# EAGLE design magicmouth-v0.1-ds (EAGLE 6.3)
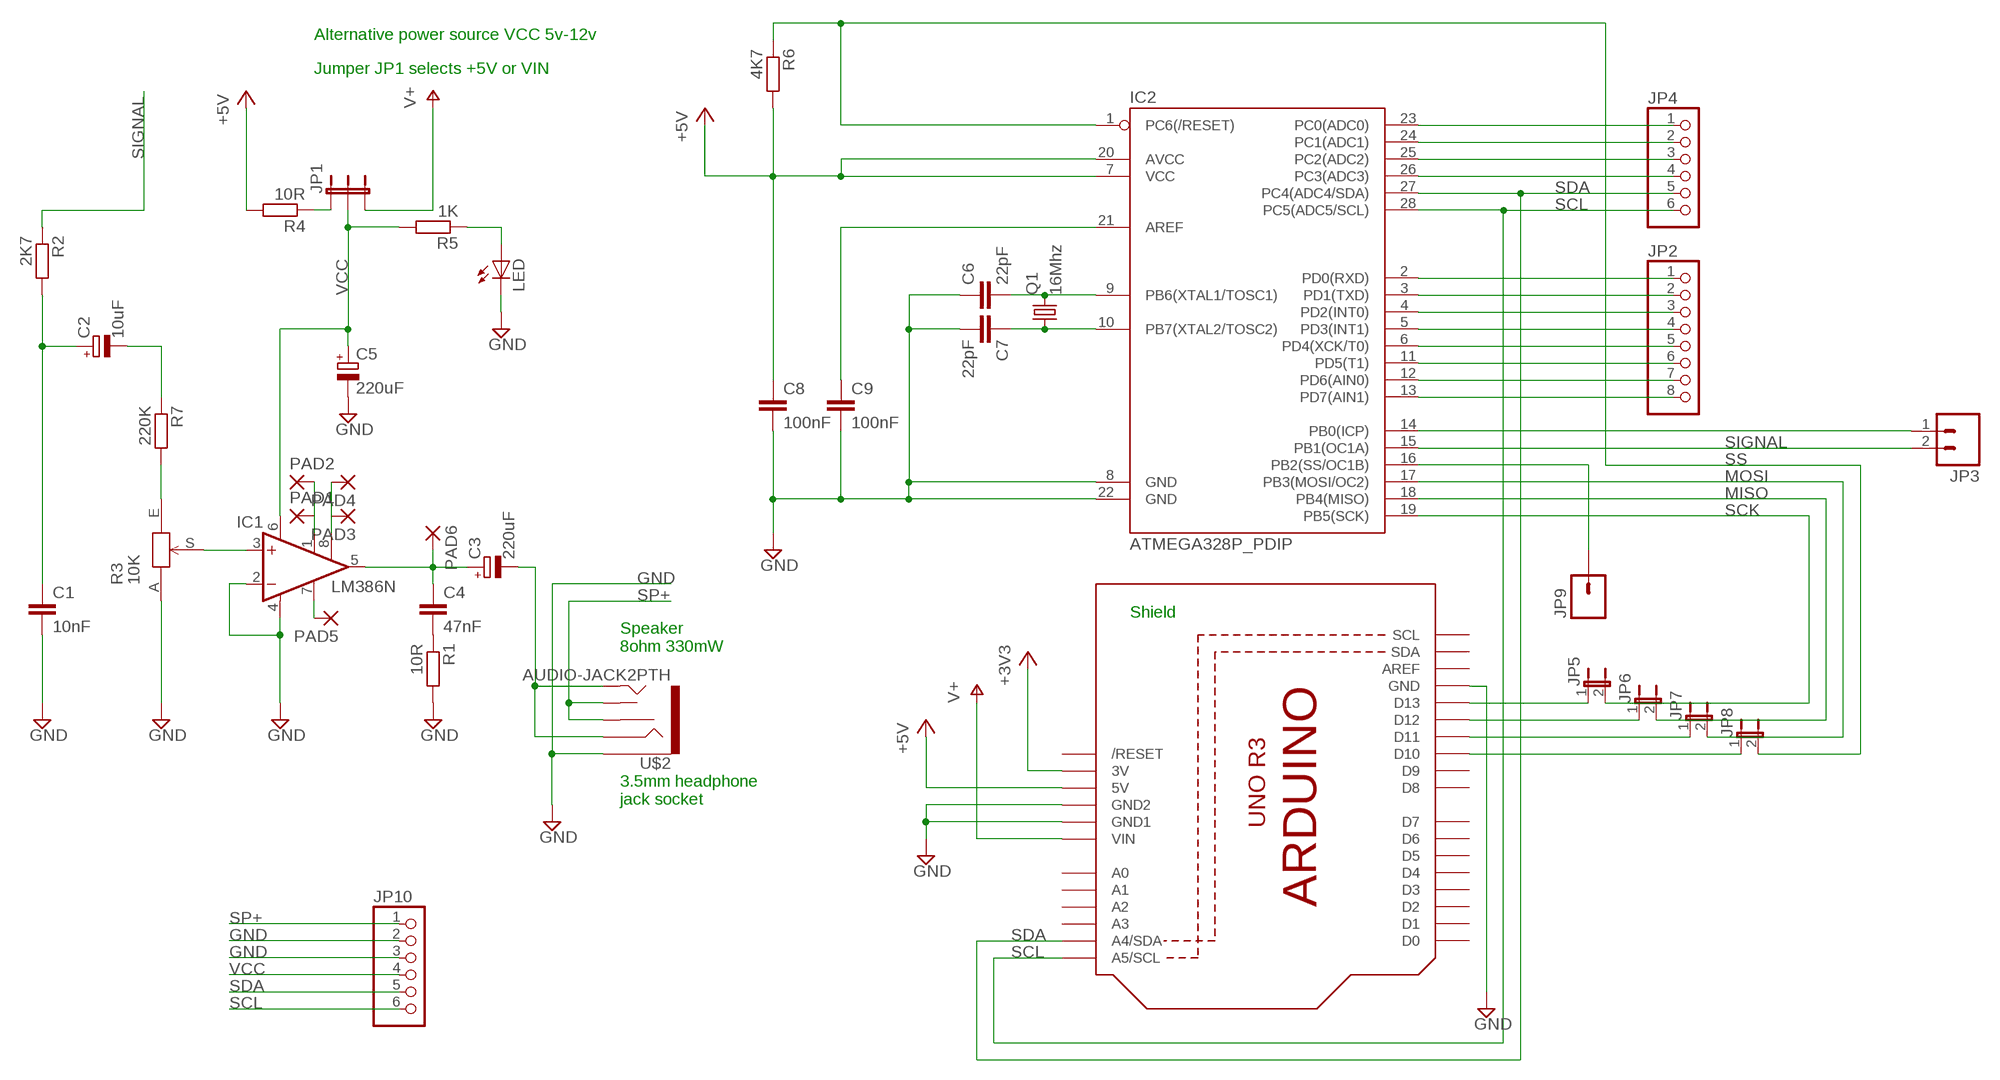
[diagram p0: schematic, sheet 1]

## Parts
C1  10nF  C-EU050-025X075  [C050-025X075]
C2  10uF  CPOL-EUE2.5-7  [E2,5-7]
C3  220uF  CPOL-EUTT2D7  [TT2D7]
C4  47nF  C-EU050-025X075  [C050-025X075]
C5  220uF  CPOL-EUTT2D7  [TT2D7]
C6  22pF  C-EU025-025X050  [C025-025X050]
C7  22pF  C-EU025-025X050  [C025-025X050]
C8  100nF  C-EU025-025X050  [C025-025X050]
C9  100nF  C-EU025-025X050  [C025-025X050]
IC1  LM386N  LM386N-1  [DIL08]
IC2  ATMEGA328P_PDIP  [DIL28-3]
JP1  JUMPER-3PTH  [1X03]
JP2  PINHD-1X8CLEANBIG  [1X08-CLEANBIG]
JP3  M021X02_NO_SILK  [1X02_NO_SILK]
JP4  PINHD-1X6CB  [1X06-CLEANBIG]
JP5  JUMPER-2PTH  [1X02]
JP6  JUMPER-2PTH  [1X02]
JP7  JUMPER-2PTH  [1X02]
JP8  JUMPER-2PTH  [1X02]
JP9  M01SMDNS  [1X01NS]
JP10  PINHD-1X6CB  [1X06-CLEANBIG]
LED  LED3MM  [LED3MM]
PAD1  1,6/0,8  [1,6/0,8]
PAD2  1,6/0,8  [1,6/0,8]
PAD3  1,6/0,8  [1,6/0,8]
PAD4  1,6/0,8  [1,6/0,8]
PAD5  1,6/0,8  [1,6/0,8]
PAD6  1,6/0,8  [1,6/0,8]
Q1  16Mhz  CRYSTALHC49S  [HC49/S]
R1  10R  R-EU_0207/7  [0207/7]
R2  2K7  R-EU_0207/7  [0207/7]
R3  10K  TPOT3352  [3352T]
R4  10R  R-EU_0207/7  [0207/7]
R5  1K  R-EU_0207/7  [0207/7]
R6  4K7  R-EU_0207/7  [0207/7]
R7  220K  R-EU_0207/7  [0207/7]
U1  ARDUINOR3-NOIOREF-NOTEXT  [ARDUINOR3-NOTEXT-NOIOREF]
U$2  AUDIO-JACK2PTH  [AUDIO-JACK]

## Nets
+3V3: U1.3V
+5V: C8.1 IC2.7(VCC) IC2.20(AVCC) R4.2 R6.2 U1.5V
D8: IC2.14(PB0(ICP)) JP3.1
GND: C1.2 C5.- C6.1 C7.2 C8.2 C9.2 IC1.2(-IN) IC1.4(GND) IC2.8(GND) IC2.22(GND) JP10.2 JP10.3 LED.K(C) R1.2 R3.A U1.GND U1.GND1 U1.GND2 U$2.SLEEVE
MISO: IC2.18(PB4(MISO)) JP6.2
MOSI: IC2.17(PB3(MOSI/OC2)) JP7.2
N$1: C3.+ C4.1 IC1.5(OUT) PAD6.1(P)
N$2: C1.1 C2.+ R2.2
N$3: C9.1 IC2.21(AREF)
N$4: C4.2 R1.1
N$5: R3.E R7.2
N$6: C6.2 IC2.9(PB6(XTAL1/TOSC1)) Q1.2
N$7: JP1.1 R4.1
N$8: C3.- U$2.RING U$2.TIP
N$9: IC1.3(+IN) R3.S
N$10: LED.A R5.1
N$11: C7.1 IC2.10(PB7(XTAL2/TOSC2)) Q1.1
N$12: IC2.16(PB2(SS/OC1B)) JP9.1
N$13: IC2.23(PC0(ADC0)) JP4.1
N$15: IC2.24(PC1(ADC1)) JP4.2
N$16: IC2.2(PD0(RXD)) JP2.1
N$17: IC2.3(PD1(TXD)) JP2.2
N$18: IC2.4(PD2(INT0)) JP2.3
N$19: IC2.5(PD3(INT1)) JP2.4
N$20: IC2.6(PD4(XCK/T0)) JP2.5
N$21: IC2.11(PD5(T1)) JP2.6
N$22: IC2.12(PD6(AIN0)) JP2.7
N$23: IC2.13(PD7(AIN1)) JP2.8
N$32: IC2.25(PC2(ADC2)) JP4.3
N$33: IC2.26(PC3(ADC3)) JP4.4
N$58: IC1.1(GAIN) PAD1.1(P) PAD2.1(P)
N$87: C2.- R7.1
N$90: JP5.1 U1.D13
N$91: JP6.1 U1.D12
N$92: JP7.1 U1.D11
N$93: JP8.1 U1.D10
N$94: IC1.7(BYPASS) PAD5.1(P)
N$101: IC1.8(GAIN) PAD3.1(P) PAD4.1(P)
SCK: IC2.19(PB5(SCK)) JP5.2
SCL: IC2.28(PC5(ADC5/SCL)) JP4.6 JP10.6 U1.A5(A5/SCL)
SDA: IC2.27(PC4(ADC4/SDA)) JP4.5 JP10.5 U1.A4(A4/SDA)
SIGNAL: IC2.15(PB1(OC1A)) JP3.2 R2.1
SP+: JP10.1 U$2.RSH U$2.TSH
SS: IC2.1(PC6(/RESET)) JP8.2 R6.1
VCC: C5.+ IC1.6(VS) JP1.2 JP10.4 R5.2
VIN: JP1.3 U1.VIN ; supply symbol labelled V+
Unconnected: U1.A0 U1.A1 U1.A2 U1.A3 U1.AREF U1.D0 U1.D1 U1.D2 U1.D3 U1.D4 U1.D5 U1.D6 U1.D7 U1.D8 U1.D9 U1.RESET(/RESET) U1.SCL U1.SDA

## Notes on the sheet
- Alternative power source VCC 5v-12v
- Jumper JP1 selects +5V or VIN
- Shield
- Speaker
  8ohm 330mW
- 3.5mm headphone
  jack socket

## Library data of the parts
C1 C4 = rcl:C-EU: CAPACITOR, European symbol
C2 C3 C5 = rcl:CPOL-EU: POLARIZED CAPACITOR, European symbol
C6 C7 = rcl:C-EU: CAPACITOR, European symbol; CAPACITANCE: 22 pf
C8 = rcl:C-EU: CAPACITOR, European symbol; CAPACITANCE: 10 nF
C9 = rcl:C-EU: CAPACITOR, European symbol; CAPACITANCE: 100 nF
IC1 = linear:LM386?-*: Low Voltage Audio Power Amplifier Source: http://cache.national.com/ds/LM/LM386.pdf
IC2 = SparkFun-DigitalIC:ATMEGA328P_PDIP: uC used in the Arduino 32kb flash, 1k EEPROM, 2k SRAM This is the through-hole version of this chip.
JP1 = SparkFun-Passives:JUMPER-3
JP2 = adafruit:PINHD-1X8: PIN HEADER
JP3 = SparkFun-Connectors:M02: Header 2 Standard 2-pin 0.1" header. Use with straight break away headers (SKU : PRT-00116), right angle break away headers (PRT-00553), swiss pins (PRT-00743), machine pins (PRT-00117), and female headers (PRT-00115). Molex polarized connector foot print use with SKU : PRT-08233 with associated crimp pins and housings.
JP4 JP10 = adafruit:PINHD-1X6: PIN HEADER
JP5-JP8 = SparkFun-Passives:JUMPER-2: Jumper Basic 0.1" spaced jumper. Use with breakaway headers.
JP9 = SparkFun-Connectors:M01: Header 1 Standard 1-pin 0.1" header. Use with straight break away headers (SKU : PRT-00116), right angle break away headers (PRT-00553), swiss pins (PRT-00743), machine pins (PRT-00117), and female headers (PRT-00115).
LED = led:LED: LED OSRAM: - CHIPLED LG R971, LG N971, LY N971, LG Q971, LY Q971, LO R971, LY R971 LH N974, LH R974 LS Q976, LO Q976, LY Q976 LO Q996 - Hyper CHIPLED LW Q18S LB Q993, LB Q99A, LB R99A - SideLED LS A670, LO A670, LY A670, LG A670, LP A670 LB A673, LV A673, LT A673, LW A673 LH A674 LY A675 LS A676, LA A676, LO A676, LY A676, LW A676 LS A679, LY A679, LG A679 - Hyper Micro SIDELED® LS Y876, LA Y876, LO Y876, LY Y876 LT Y87S - SmartLED LW L88C, LW L88S LB L89C, LB L89S, LG L890 LS L89K, LO L89K, LY L89K LS L896, LA L896, LO L896, LY L896 - TOPLED LS T670, LO T670, LY T670, LG T670, LP T670 LSG T670, LSP T670, LSY T670, LOP T670, LYG T670 LG T671, LOG T671, LSG T671 LB T673, LV T673, LT T673, LW T673 LH T674 LS T676, LA T676, LO T676, LY T676, LB T676, LH T676, LSB T676, LW T676 LB T67C, LV T67C, LT T67C, LS T67K, LO T67K, LY T67K, LW E67C LS E67B, LA E67B, LO E67B, LY E67B, LB E67C, LV E67C, LT E67C LW T67C LS T679, LY T679, LG T679 LS T770, LO T770, LY T770, LG T770, LP T770 LB T773, LV T773, LT T773, LW T773 LH T774 LS E675, LA E675, LY E675, LS T675 LS T776, LA T776, LO T776, LY T776, LB T776 LHGB T686 LT T68C, LB T68C - Hyper Mini TOPLED® LB M676 - Mini TOPLED Santana® LG M470 LS M47K, LO M47K, LY M47K Source: http://www.osram.convergy.de - LUMILED® LXK2-PW12-R00, LXK2-PW12-S00, LXK2-PW14-U00, LXK2-PW14-V00 LXK2-PM12-R00, LXK2-PM12-S00, LXK2-PM14-U00 LXK2-PE12-Q00, LXK2-PE12-R00, LXK2-PE12-S00, LXK2-PE14-T00, LXK2-PE14-U00 LXK2-PB12-K00, LXK2-PB12-L00, LXK2-PB12-M00, LXK2-PB14-N00, LXK2-PB14-P00, LXK2-PB14-Q00 LXK2-PR12-L00, LXK2-PR12-M00, LXK2-PR14-Q00, LXK2-PR14-R00 LXK2-PD12-Q00, LXK2-PD12-R00, LXK2-PD12-S00 LXK2-PH12-R00, LXK2-PH12-S00 LXK2-PL12-P00, LXK2-PL12-Q00, LXK2-PL12-R00 Source: www.luxeon.com
PAD1-PAD6 = wirepad:1,6/0,8: THROUGH-HOLE PAD
Q1 = crystal:CRYSTAL: CRYSTAL; OC_FARNELL: 1667008; OC_NEWARK: unknown
R1 R7 = resistor:R-EU_: RESISTOR, European symbol
R2 R4 R5 = rcl:R-EU_: RESISTOR, European symbol
R3 = t0mpr1c3:TPOT: Bourns thumbwheel trimmer resistor
R6 = rcl:R-EU_: RESISTOR, European symbol; RESISTANCE: 4K7
U1 = adafruit:ARDUINOR3-NOIOREF
U$2 = SparkFun-Connectors:AUDIO-JACK2: Stereo audio jack with bypass switches.

## Board
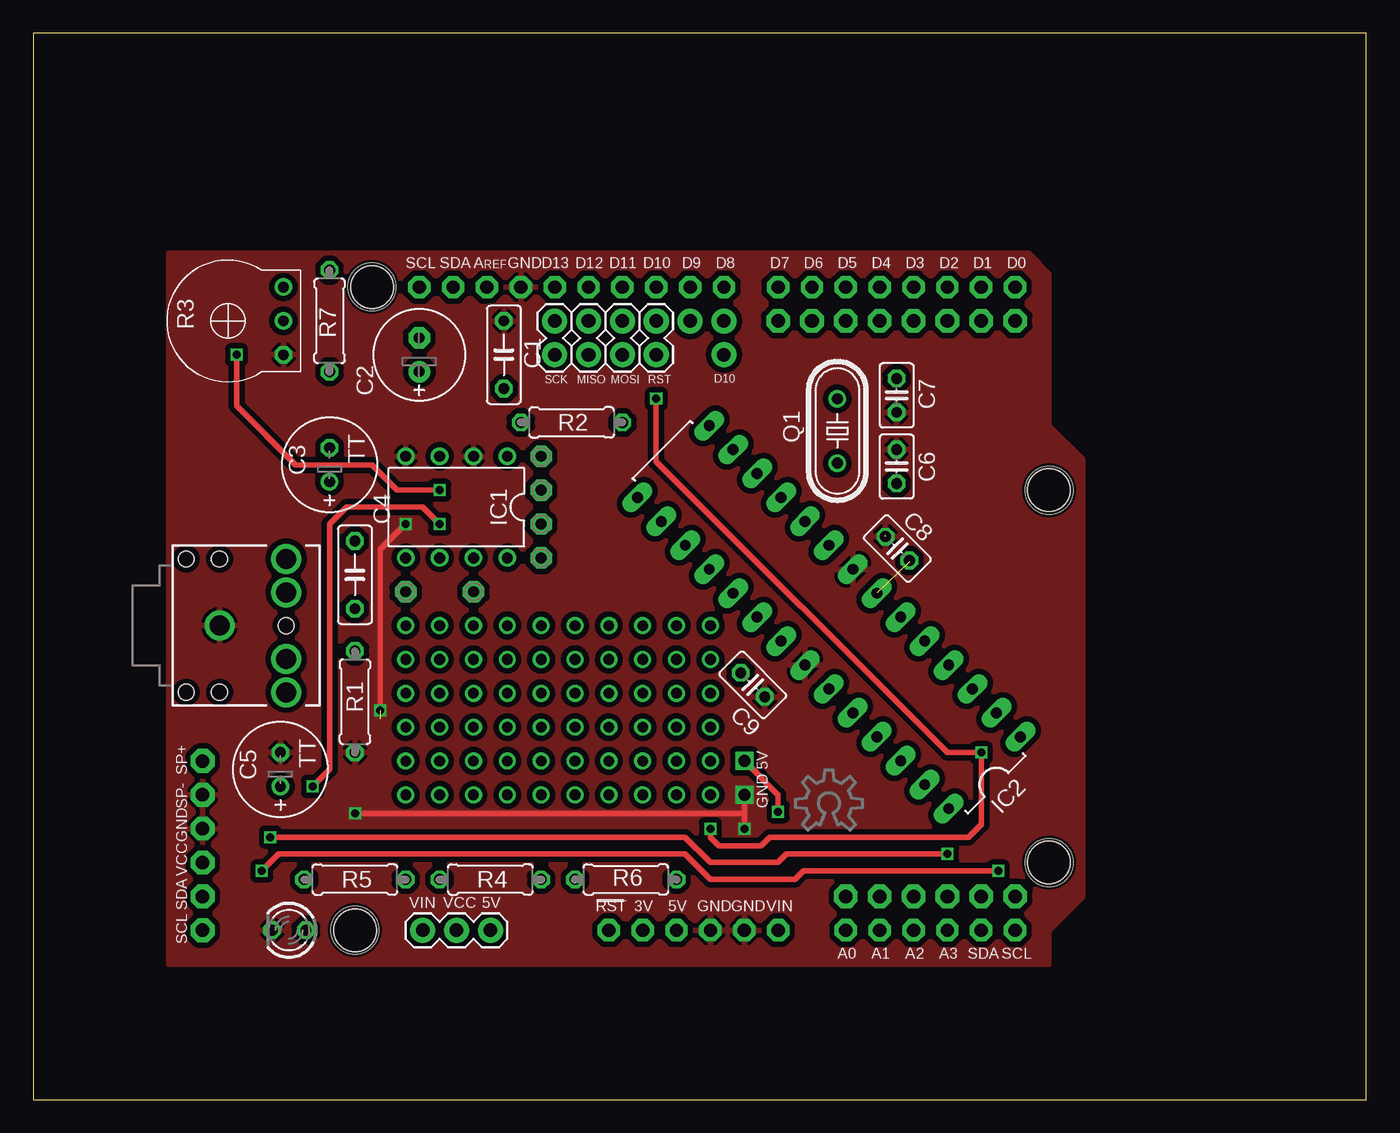
[diagram p1: board, top side]
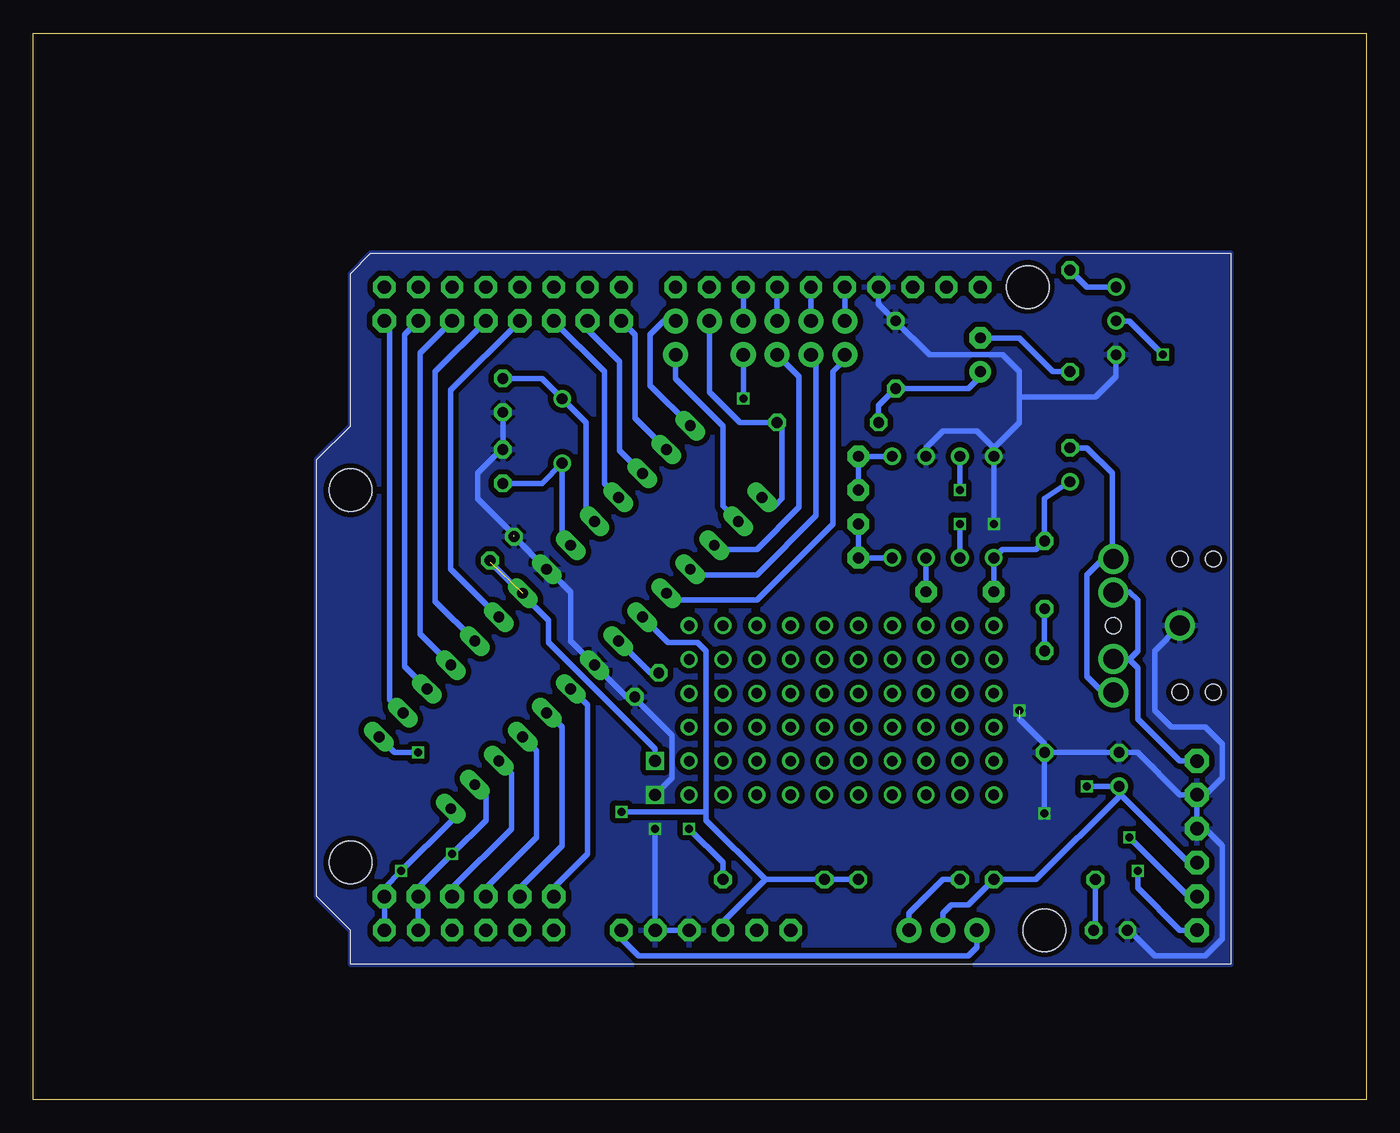
[diagram p2: board, bottom side, seen from below]

Size 100 x 80 mm. Coordinates in mm from the lower left corner, seen from the top.
Outline: 0,0 100,0 100,80 0,80 0,0
Copper layers (1*16): Top 0.035mm / dielectric 1.5mm / Bottom 0.035mm
Design rules "Fusion_eagle_rule_v1.1": minimum track width 6mil, minimum drill 12mil, track to track 6mil, track to pad 6mil, pad to pad 6mil, via to via 6mil, smd to smd 0mil, copper to edge 10mil, drill to drill 10mil, minimum pad ring 10mil, minimum via ring 6mil, stop-mask expansion 2mil, vias tented up to drill 100mil, thermal gap 10mil
Holes 3.2 mm at 76.2,45.72 76.2,17.78 24.13,12.7 25.4,60.96

### Footprints (pad centres in the part's own frame; a part is rotated, then mirrored left to right if it is on the bottom)
C050-025X075 = drill 0.813 octagon: 1 -2.54,0; 2 2.54,0
E2,5-7 = drill 0.813 pad 1.6: + -1.27,0 | drill 0.813 pad 1.6 octagon: - 1.27,0
TT2D7 = drill 0.813: + -1.27,0 | drill 0.813 octagon: - 1.27,0
C025-025X050 = drill 0.813 octagon: 1 -1.27,0; 2 1.27,0
DIL08 = drill 0.813 pad 1.27: 1 -3.81,-3.81; 2 -1.27,-3.81; 3 1.27,-3.81; 4 3.81,-3.81; 5 3.81,3.81; 6 1.27,3.81; 7 -1.27,3.81; 8 -3.81,3.81
DIL28-3 = drill 0.813 long: 1 -16.51,-3.81; 2 -13.97,-3.81; 3 -11.43,-3.81; 4 -8.89,-3.81; 5 -6.35,-3.81; 6 -3.81,-3.81; 7 -1.27,-3.81; 8 1.27,-3.81; 9 3.81,-3.81; 10 6.35,-3.81; 11 8.89,-3.81; 12 11.43,-3.81; 13 13.97,-3.81; 14 16.51,-3.81; 15 16.51,3.81; 16 13.97,3.81; 17 11.43,3.81; 18 8.89,3.81; 19 6.35,3.81; 20 3.81,3.81; 21 1.27,3.81; 22 -1.27,3.81; 23 -3.81,3.81; 24 -6.35,3.81; 25 -8.89,3.81; 26 -11.43,3.81; 27 -13.97,3.81; 28 -16.51,3.81
1X03 = drill 1.016 pad 1.88: 1 0,0; 2 2.54,0; 3 5.08,0
1X08-CLEANBIG = drill 1.016 pad 1.778 octagon: 1 -8.89,0; 2 -6.35,0; 3 -3.81,0; 4 -1.27,0; 5 1.27,0; 6 3.81,0; 7 6.35,0; 8 8.89,0
1X02_NO_SILK = drill 1.016 pad 1.88: 1 0,0; 2 2.54,0
1X06-CLEANBIG = drill 1.016 pad 1.778 octagon: 1 -6.35,0; 2 -3.81,0; 3 -1.27,0; 4 1.27,0; 5 3.81,0; 6 6.35,0
1X02 = drill 1.016 pad 1.88: 1 0,0; 2 2.54,0
1X01NS = drill 1.016 pad 1.88: 1 0,0
LED3MM = drill 0.813 octagon: A -1.27,0; K 1.27,0
1,6/0,8 = drill 0.813 pad 1.6 octagon: 1 0,0
HC49/S = drill 0.813: 1 -2.413,0; 2 2.413,0
0207/7 = drill 0.813 octagon: 1 -3.81,0; 2 3.81,0
3352T = drill 0.8 pad 1.27 octagon: A -2.54,-4.16 | drill 0.8 pad 1.27: E 2.54,-4.16; S 0,-4.16
ARDUINOR3-NOTEXT-NOIOREF = drill 1 pad 1.676 octagon: 3V 35.56,2.54; 5V 38.1,2.54; A0 50.8,2.54; A1 53.34,2.54; A2 55.88,2.54; A3 58.42,2.54; A4 60.96,2.54; A5 63.5,2.54; AREF 23.876,50.8; D0 63.5,50.8; D1 60.96,50.8; D2 58.42,50.8; D3 55.88,50.8; D4 53.34,50.8; D5 50.8,50.8; D6 48.26,50.8; D7 45.72,50.8; D8 41.656,50.8; D9 39.116,50.8; D10 36.576,50.8; D11 34.036,50.8; D12 31.496,50.8; D13 28.956,50.8; GND 26.416,50.8; GND1 43.18,2.54; GND2 40.64,2.54; RESET 33.02,2.54; SCL 18.796,50.8; SDA 21.336,50.8; VIN 45.72,2.54
AUDIO-JACK = drill 1.5 pad 2.184: RING 5,5; RSH 5,2.5; SLEEVE 0,0; TIP 5,-5; TSH 5,-2.5 | hole 1.2: 0,5; -2.5,5; -2.5,-5; 0,-5; 5,0

### Placement (x,y rotation side)
C1  35.31,55.88 90 top
C2  28.96,55.88 90 top
C3  22.23,47.62 90 top
C4  24.13,39.37 270 top
C5  18.54,24.77 90 top
C6  64.77,47.5 270 top
C7  64.77,52.83 270 top
C8  64.83,41.34 135 top
C9  53.98,31.11 315 top
IC1  31.75,44.45 180 top
IC2  59.69,36.2 135 top
JP1  34.29,12.7 180 top
JP2  64.77,58.42 180 top
JP3  51.82,58.42 180 top
JP4  67.31,15.24 0 top
JP5  39.12,58.42 270 top
JP6  41.66,58.42 270 top
JP7  44.2,58.42 270 top
JP8  46.74,58.42 270 top
JP9  51.82,55.88 180 top
JP10  12.7,19.05 270 top
LED  19.18,12.7 180 top
PAD1  38.1,48.26 0 top
PAD2  38.1,45.72 0 top
PAD3  38.1,40.64 0 top
PAD4  38.1,43.18 0 top
PAD5  33.02,38.1 0 top
PAD6  27.94,38.1 0 top
Q1  60.33,50.16 270 top
R1  24.13,29.84 270 top
R2  40.39,50.8 180 top
R3  14.61,58.42 90 top
R4  34.29,16.51 0 top
R5  24.13,16.51 0 top
R6  44.45,16.51 180 top
R7  22.23,58.42 90 top
U1  10.16,10.16 0 top
U$1  [OSHWLOGO_TOL_0.2]  59.69,22.23 0 top
U$2  13.97,35.56 0 top

### Tracks (layer width: path | path; a pad name or v marks a point on that pad's centre or on a via)
+5V  (via drill 0.6, 0.9 pad 1.27)  (1 unrouted)
  Top 0.406: v55.88,21.59 55.88,22.86 v53.34,25.4
  Bottom 0.406: C8.1 65.73,40.33 61.34,35.94 61.34,34.29 53.34,26.29 v53.34,25.4 | 45.09,16.51 R6.2 R4.2 | 45.09,16.51 48.26,13.34 U1.5V | 49.53,21.59 49.53,33.66 50.16,34.29 52.4,34.29 IC2.20 | 49.53,21.59 v55.88,21.59 | 49.53,21.59 49.53,20.95 45.09,16.51
D8
  Bottom 0.406: JP3.1 52.7,58.42 53.72,57.4 53.72,53.58 IC2.14
GND  (via drill 0.6, 0.9 pad 1.27)  (2 unrouted)
  Top 0.406: 53.34,21.46 v53.34,22.86 | 53.34,21.46 v24.13,21.46 | 53.34,21.46 v53.34,20.32 | v26.04,29.21 26.04,41.27 v27.94,43.18
  Bottom 0.406: JP10.2 12.06,22.86 10.79,24.13 10.79,26.67 12.06,27.94 14.61,27.94 15.88,29.21 15.88,33.66 U$2.SLEEVE | JP10.2 JP10.3 12.06,20.32 10.79,19.05 10.79,12.06 12.06,10.79 15.88,10.79 17.78,12.7 LED.K | v24.13,21.46 R1.2 | U1.GND 36.58,59.69 C1.2 32.77,55.88 27.3,55.88 26.04,54.61 26.04,52.7 | R3.A 18.77,54.26 20.32,52.7 26.04,52.7 | IC1.2 33.02,48.9 31.75,50.16 29.21,50.16 27.94,48.9 | 27.94,48.9 IC1.4 v27.94,43.18 | 27.94,48.9 26.04,50.8 26.04,52.7 | R1.2 24.13,26.67 26.04,28.57 | JP10.2 13.97,22.86 17.14,26.04 C5.- R1.2 | C7.2 C6.1 64.9,48.77 66.67,46.99 66.67,45.09 63.94,42.34 | IC2.8 | IC2.8 C8.2 | IC2.8 61.38,39.79 59.69,38.1 59.69,34.4 IC2.22 55.51,30.22 C9.2 54.87,30.11 52.07,27.3 52.07,24.13 v53.34,22.86 | U1.GND2 U1.GND1 v53.34,20.32
  pour Bottom (isolate 0.406): 76.2,12.7 78.74,15.24 78.74,48.01 76.2,50.55 76.2,61.98 74.68,63.5 10.16,63.5 10.16,10.16 76.2,10.16
  pour Top (isolate 0.406): 10.16,10.16 10.16,63.5 74.68,63.5 76.2,61.98 76.2,50.55 78.74,48.01 78.74,15.24 76.2,12.7 76.2,10.16
MISO
  Bottom 0.406: JP6.2 41.27,55.5 41.27,43.81 45.72,39.37 50.29,39.37 IC2.18
MOSI
  Bottom 0.406: JP7.2 42.55,54.23 42.55,44.45 45.72,41.27 48.61,41.27 IC2.17
N$1
  Bottom 0.406: PAD6.1 IC1.5 27.3,41.27 24.77,41.27 C4.1 24.13,45.09 C3.+
N$2
  Bottom 0.406: C2.+ 28.96,54.23 29.84,53.34 C1.1 36.58,52.07 R2.2
N$3
  Bottom 0.406: C9.1 53.71,32.01 IC2.21
N$4
  Bottom 0.406: C4.2 R1.1
N$5
  Bottom 0.406: R3.E 20.95,60.96 R7.2
N$6
  Bottom 0.406: C6.2 61.85,46.23 Q1.2 60.33,42.22 IC2.9
N$7
  Bottom 0.406: R4.1 31.75,16.51 34.29,13.97 JP1.1
N$8
  Bottom 0.406: C3.- 20.95,48.9 19.05,46.99 19.05,40.64 | U$2.TIP 19.05,30.48 19.68,30.48 20.95,31.75 20.95,39.37 19.68,40.64 19.05,40.64 | 19.05,40.64 U$2.RING
N$9  (via drill 0.6)
  Top 0.406: v15.24,55.88 15.24,52.07 19.68,47.62 25.4,47.62 27.3,45.72 v30.48,45.72
  Bottom 0.406: R3.S 17.78,58.42 v15.24,55.88 | v30.48,45.72 IC1.3
N$10
  Bottom 0.406: R5.1 20.32,13.34 20.45,13.21 LED.A
N$11
  Bottom 0.406: C7.1 61.85,54.1 Q1.1 58.55,50.8 58.55,44.03 IC2.10
N$12
  Bottom 0.406: JP9.1 51.82,54.1 48.26,50.55 48.26,44.52 IC2.16
N$13
  Bottom 0.406: JP4.1 60.96,15.88 58.42,18.41 58.42,29.59 59.64,30.81 IC2.23
N$15
  Bottom 0.406: JP4.2 63.5,15.88 60.33,19.05 60.33,27.94 61.4,29.01 IC2.24
N$16
  Bottom 0.406: JP2.1 73.28,58.04 73.28,30.03 IC2.2
N$17
  Bottom 0.406: JP2.2 72.14,57.4 72.14,32.48 IC2.3
N$18
  Bottom 0.406: JP2.3 70.99,56.01 70.99,34.93 IC2.4
N$19
  Bottom 0.406: JP2.4 69.85,54.61 69.85,37.38 IC2.5
N$20
  Bottom 0.406: JP2.5 68.71,53.21 68.71,39.82 IC2.6
N$21
  Bottom 0.406: JP2.6 57.15,54.61 57.15,46.23 IC2.11
N$22
  Bottom 0.406: JP2.7 58.42,57.78 56.01,55.37 56.01,48.68 IC2.12
N$23
  Bottom 0.406: JP2.8 54.86,57.4 54.86,51.13 IC2.13
N$25  (via drill 0.8 pad 1.27)
  other vias: 40.64,35.56
N$26  (via drill 0.8 pad 1.27)
  other vias: 43.18,35.56
N$28  (via drill 0.8 pad 1.27)
  other vias: 45.72,35.56
N$29  (via drill 0.8 pad 1.27)
  other vias: 45.72,33.02
N$32
  Bottom 0.406: JP4.3 66.04,15.88 62.23,19.68 62.23,26.16 IC2.25
N$33
  Bottom 0.406: JP4.4 68.58,15.88 64.14,20.32 64.14,24.48 IC2.26
N$34  (via drill 0.8 pad 1.27)
  other vias: 43.18,33.02
N$35  (via drill 0.8 pad 1.27)
  other vias: 40.64,33.02
N$36  (via drill 0.8 pad 1.27)
  other vias: 40.64,30.48
N$37  (via drill 0.8 pad 1.27)
  other vias: 43.18,30.48
N$38  (via drill 0.8 pad 1.27)
  other vias: 45.72,30.48
N$39  (via drill 0.8 pad 1.27)
  other vias: 45.72,27.94
N$40  (via drill 0.8 pad 1.27)
  other vias: 43.18,27.94
N$41  (via drill 0.8 pad 1.27)
  other vias: 40.64,27.94
N$42  (via drill 0.8 pad 1.27)
  other vias: 40.64,25.4
N$43  (via drill 0.8 pad 1.27)
  other vias: 43.18,25.4
N$44  (via drill 0.8 pad 1.27)
  other vias: 45.72,25.4
N$45  (via drill 0.8 pad 1.27)
  other vias: 45.72,22.86
N$46  (via drill 0.8 pad 1.27)
  other vias: 43.18,22.86
N$47  (via drill 0.8 pad 1.27)
  other vias: 48.26,35.56
N$48  (via drill 0.8 pad 1.27)
  other vias: 50.8,35.56
N$49  (via drill 0.8 pad 1.27)
  other vias: 48.26,33.02
N$50  (via drill 0.8 pad 1.27)
  other vias: 50.8,33.02
N$51  (via drill 0.8 pad 1.27)
  other vias: 48.26,30.48
N$52  (via drill 0.8 pad 1.27)
  other vias: 50.8,30.48
N$53  (via drill 0.8 pad 1.27)
  other vias: 40.64,22.86
N$54  (via drill 0.8 pad 1.27)
  other vias: 27.94,35.56
N$56  (via drill 0.8 pad 1.27)
  other vias: 33.02,35.56
N$57  (via drill 0.8 pad 1.27)
  other vias: 35.56,35.56
N$58
  Bottom 0.406: PAD2.1 PAD1.1 IC1.1
N$59  (via drill 0.8 pad 1.27)
  other vias: 38.1,33.02
N$60  (via drill 0.8 pad 1.27)
  other vias: 35.56,33.02
N$61  (via drill 0.8 pad 1.27)
  other vias: 33.02,33.02
N$62  (via drill 0.8 pad 1.27)
  other vias: 30.48,33.02
N$63  (via drill 0.8 pad 1.27)
  other vias: 27.94,33.02
N$64  (via drill 0.8 pad 1.27)
  other vias: 27.94,30.48
N$65  (via drill 0.8 pad 1.27)
  other vias: 30.48,30.48
N$66  (via drill 0.8 pad 1.27)
  other vias: 33.02,30.48
N$67  (via drill 0.8 pad 1.27)
  other vias: 35.56,30.48
N$68  (via drill 0.8 pad 1.27)
  other vias: 38.1,30.48
N$69  (via drill 0.8 pad 1.27)
  other vias: 38.1,27.94
N$70  (via drill 0.8 pad 1.27)
  other vias: 35.56,27.94
N$71  (via drill 0.8 pad 1.27)
  other vias: 33.02,27.94
N$72  (via drill 0.8 pad 1.27)
  other vias: 30.48,27.94
N$73  (via drill 0.8 pad 1.27)
  other vias: 27.94,27.94
N$74  (via drill 0.8 pad 1.27)
  other vias: 27.94,25.4
N$75  (via drill 0.8 pad 1.27)
  other vias: 48.26,27.94
N$76  (via drill 0.8 pad 1.27)
  other vias: 30.48,25.4
N$77  (via drill 0.8 pad 1.27)
  other vias: 33.02,25.4
N$78  (via drill 0.8 pad 1.27)
  other vias: 35.56,25.4
N$79  (via drill 0.8 pad 1.27)
  other vias: 38.1,25.4
N$80  (via drill 0.8 pad 1.27)
  other vias: 38.1,22.86
N$81  (via drill 0.8 pad 1.27)
  other vias: 35.56,22.86
N$82  (via drill 0.8 pad 1.27)
  other vias: 33.02,22.86
N$83  (via drill 0.8 pad 1.27)
  other vias: 30.48,22.86
N$84  (via drill 0.8 pad 1.27)
  other vias: 27.94,22.86
N$85  (via drill 0.8 pad 1.27)
  other vias: 50.8,27.94
N$86  (via drill 0.8 pad 1.27)
  other vias: 48.26,25.4
N$87
  Bottom 0.406: R7.1 23.5,54.61 26.04,57.15 C2.-
N$88  (via drill 0.8 pad 1.27)
  other vias: 50.8,25.4
N$89  (via drill 0.8 pad 1.27)
  other vias: 48.26,22.86
N$90
  Bottom 0.406: U1.D13 JP5.1
N$91
  Bottom 0.406: U1.D12 JP6.1
N$92
  Bottom 0.406: U1.D11 JP7.1
N$93
  Bottom 0.406: U1.D10 JP8.1
N$94
  Bottom 0.406: IC1.7 PAD5.1
N$97  (via drill 0.8 pad 1.27)
  other vias: 50.8,22.86
N$98  (via drill 0.8 pad 1.27)
  other vias: 30.48,35.56
N$99  (via drill 0.8 pad 1.27)
  other vias: 38.1,35.56
N$101
  Bottom 0.406: IC1.8 PAD3.1 PAD4.1
SCK
  Bottom 0.406: JP5.2 39.12,55.5 40.01,54.61 40.01,43.18 45.72,37.47 51.98,37.47 IC2.19
SCL  (via drill 0.6)
  Top 0.406: v72.39,17.14 57.78,17.14 57.15,16.51 50.8,16.51 48.9,18.41 18.41,18.41 v17.14,17.14
  Bottom 0.406: 68.58,21.59 68.58,20.95 v72.39,17.14 73.66,15.88 JP4.6 U1.A5 | 68.58,21.59 68.58,21.74 | JP10.6 13.97,12.7 17.14,15.88 v17.14,17.14 | IC2.28 68.67,21.68 68.58,21.59
SDA  (via drill 0.6)
  Top 0.406: v17.78,19.68 48.9,19.68 50.8,17.78 55.88,17.78 56.52,18.41 v68.58,18.41
  Bottom 0.406: JP10.5 13.34,15.24 v17.78,19.68 | IC2.27 66.8,23.62 66.04,22.86 66.04,20.95 v68.58,18.41 71.12,15.88 JP4.5 U1.A4
SIGNAL
  Bottom 0.406: JP3.2 49.28,53.09 46.99,50.8 R2.1 43.81,50.42 43.81,45.09 44.45,44.45 44.6,44.45 IC2.15
SP+
  Bottom 0.406: 17.78,33.02 18.93,33.02 U$2.TSH 17.74,33.06 | U$2.RSH 18.93,38.1 17.78,38.1 17.14,37.47 17.14,33.66 17.78,33.02 | 13.34,25.4 JP10.1 13.97,25.4 17.14,28.57 17.14,32.38 17.78,33.02
SS  (via drill 0.6)
  Top 0.406: v46.74,52.58 46.74,47.88 68.58,26.04 v71.12,26.04 71.12,20.64 70.17,19.68 55.24,19.68 54.61,19.05 51.44,19.05 50.8,19.68 v50.8,20.32
  Bottom 0.406: JP8.2 v46.74,52.58 | v71.12,26.04 72.88,26.04 IC2.1 | R6.1 48.26,17.78 v50.8,20.32
VCC  (via drill 0.6)
  Top 0.406: v30.48,43.18 29.21,44.45 23.5,44.45 22.23,43.18 22.23,24.77 v20.95,23.5
  Bottom 0.406: IC1.6 v30.48,43.18 | v20.95,23.5 C5.+ 18.41,23.37 18.41,22.86 | JP1.2 31.75,13.97 31.11,14.61 29.84,14.61 R5.2 24.77,16.51 18.41,22.86 | JP10.4 13.34,17.78 18.41,22.86
VIN
  Bottom 0.406: U1.VIN 55.88,12.06 54.61,10.79 29.84,10.79 29.21,11.43 JP1.3

### Text on the board
tPlace: SCL | SDA | A | REF | GND | D13 | D12 | D11 | D10 | D9 | D8 | D7 | D6 | D5 | D4 | D3 | D2 | D1 | D0 | SCK | MISO | MOSI | RST | D10 | 5V | SP+ | SP- | GND | GND | VCC | _ | SDA | VIN | VCC | 5V | RST | 3V | 5V | GND | GND | VIN | SCL | A0 | A1 | A2 | A3 | SDA | SCL
tDocu: Magic Mouth v0.1 | http://is.gd/magicmouth | CC BY-SA 3.0